# Altium schematic sheet Connectors.SchDoc
size A
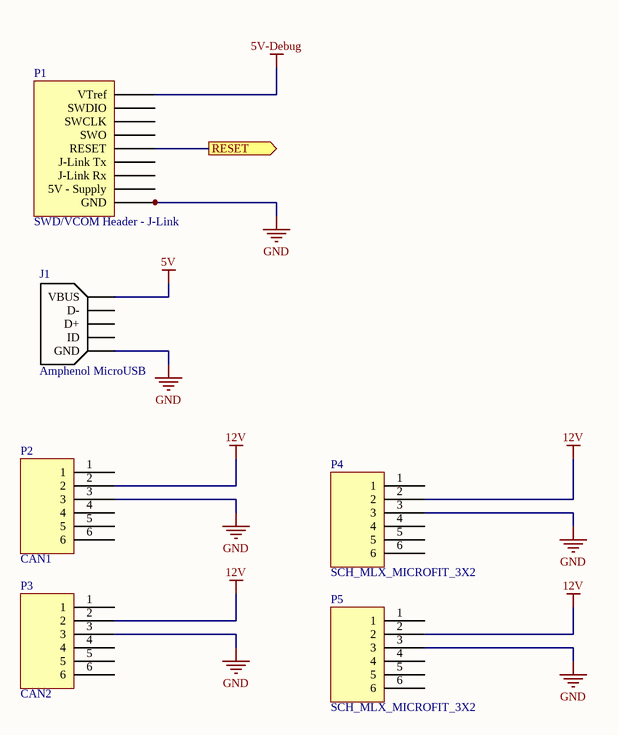
[diagram p0: Connectors.SchDoc]

## Parts
J1  Amphenol MicroUSB  [Amphenol MicroUSB]
P1  SWD/VCOM Header - J-Link  [20 Pin 100 Mil Shrouded header with key]
P2  CAN1  [PCB_MLX_MICROFIT_3X2]
P3  CAN2  [PCB_MLX_MICROFIT_3X2]
P4  SCH_MLX_MICROFIT_3X2  [PCB_MLX_MICROFIT_3X2]
P5  SCH_MLX_MICROFIT_3X2  [PCB_MLX_MICROFIT_3X2]

## Ports
RESET (out)

## Nets
5V: J1.1(VBUS)
5V-Debug: P1.1(VTref)
12V: P2.2 P3.2 P4.2 P5.2
GND: J1.5(GND) P1.4(GND) P1.6(GND) P1.8(GND) P1.10(GND) P1.12(GND) P2.3 P3.3 P4.3 P5.3
RESET: P1.15(RESET) ; port RESET

Not connected (* = marked no-connect by the designer): J1 2(D-) 3(D+) 4(ID); P1 5(J-Link_Tx) 7(SWDIO) 9(SWCLK) 13(SWO) 17(J-Link_Rx) 19(5V_-_Supply); P2 1 4 5 6; P3 1 4 5 6; P4 1 4 5 6; P5 1 4 5 6

## Library data of the parts
J1 = Amphenol MicroUSB - 609-4618-1-ND
P1 = SWD/VCOM Header
P2 P3 = SCH_MLX_MICROFIT_3X2
  P2: ID: CAN1
  P3: ID: CAN2